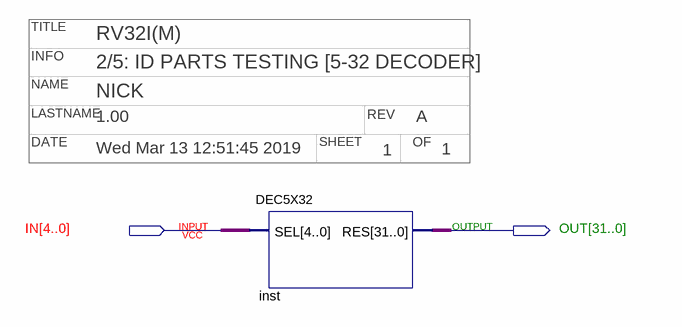
[diagram p0: schematic sheet]
// Quartus schematic DEC5X32TEST.bdf as structural Verilog: 1 symbols, 2 pins
// Title block: TITLE: RV32I(M); INFO: 2/5: ID PARTS TESTING [5-32 DECODER]; NAME: NICK; LASTNAME: 1.00; REV: A; DATE: Wed Mar 13 12:51:45 2019; SHEET: 1; OF: 1
module DEC5X32TEST (
  input  [4:0] IN,
  output [31:0] OUT
);

  DEC5X32 inst (.SEL(IN), .RES(OUT));
endmodule
